# Altium schematic sheet HELPME.SchDoc
size Legal
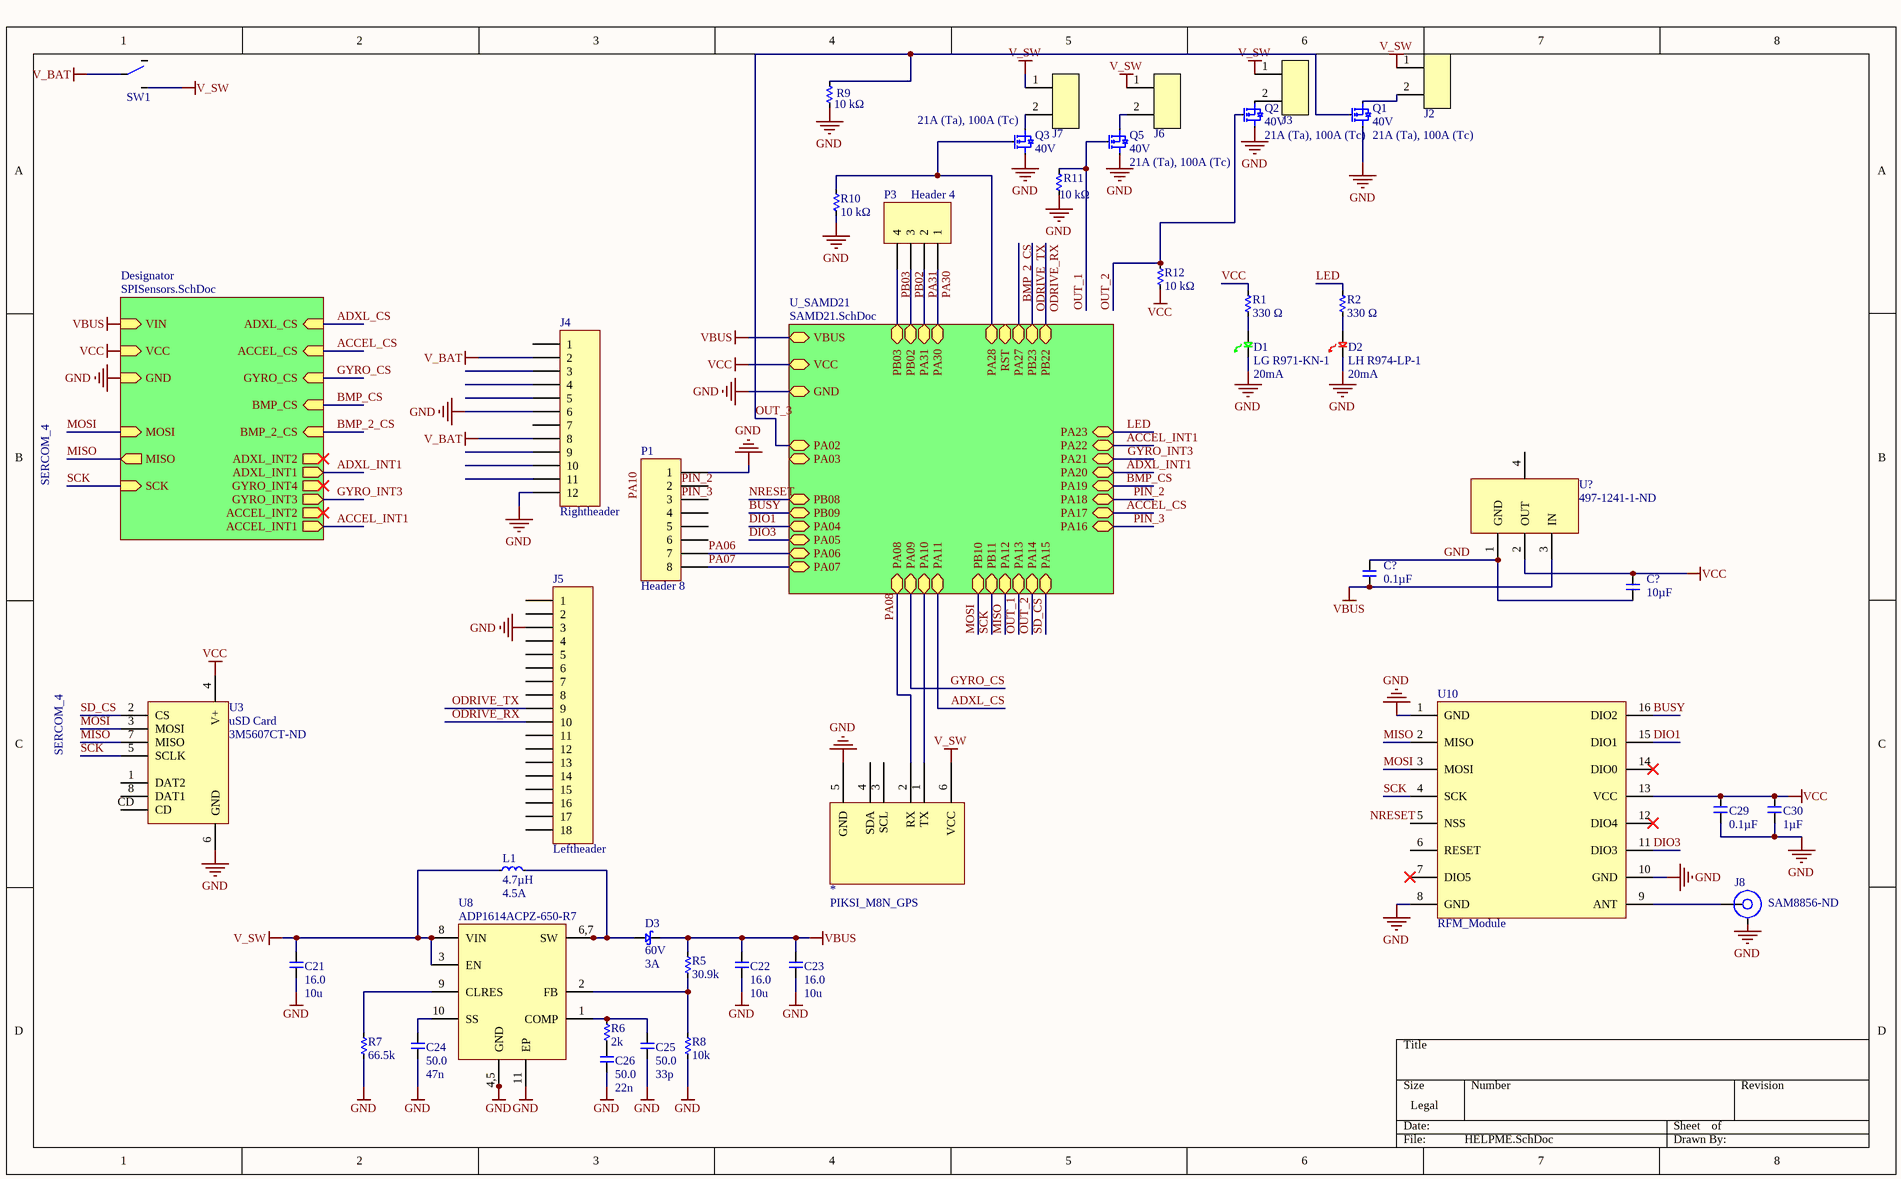
[diagram p0: HELPME.SchDoc]

## Parts
(Parts that share a designator on the sheet are numbered #1, #2 ... from top to bottom, then left to right.)
*  PIKSI_M8N_GPS  [PIKSI_M8N_GPS]
C21  voltage: 16.0  human_value: 10u  [C0805]  (hidden comment: __template_cap)
C22  voltage: 16.0  human_value: 10u  [C0805]  (hidden comment: __template_cap)
C23  voltage: 16.0  human_value: 10u  [C0805]  (hidden comment: __template_cap)
C24  voltage: 50.0  human_value: 47n  [C0805]  (hidden comment: __template_cap)
C25  voltage: 50.0  human_value: 33p  [C0805]  (hidden comment: __template_cap)
C26  voltage: 50.0  human_value: 22n  [C0805]  (hidden comment: __template_cap)
C29  Capacitance (shorthand): 0.1µF  [C0603]  (hidden comment: __template_cap)
C30  Capacitance (shorthand): 1µF  [C0603]  (hidden comment: __template_cap)
C?#1  Capacitance (shorthand): 0.1µF  [C0603]  (hidden comment: __template_cap)
C?#2  Capacitance (shorthand): 10µF  [C0603]  (hidden comment: __template_cap)
D1  Manufacturer Part Number: LG R971-KN-1  Current - Test: 20mA  [0805_Diode]  (hidden comment: LED_LY971)
D2  Manufacturer Part Number: LH R974-LP-1  Current - Test: 20mA  [0805_Diode]  (hidden comment: LED_LY974)
D3  Voltage - DC Reverse (Vr) (Max): 60V  Current - Average Rectified (Io): 3A  [SMA]  (hidden comment: SCHOTTKY_B360A-13-F)
J2  CONN_BARRIER_STRIP_2POS  [TE_BARRIER_STRIP_2POS]  (value not drawn)
J3  CONN_BARRIER_STRIP_2POS  [TE_BARRIER_STRIP_2POS]  (value not drawn)
J4  Rightheader  [HDR1X12]
J5  Leftheader  [HDR1X18]
J6  CONN_BARRIER_STRIP_2POS  [TE_BARRIER_STRIP_2POS]  (value not drawn)
J7  CONN_BARRIER_STRIP_2POS  [TE_BARRIER_STRIP_2POS]  (value not drawn)
J8  Supplier Part Number 1: SAM8856-ND  [SMA_SAMTEC_SMA-J-P-X-RA-TH1]  (hidden comment: SMA_SAMTEC_TH_RA)
L1  Inductance: 4.7µH  Current Rating: 4.5A  [SMD5230]  (hidden comment: IND_IHLP2020CZER4R7M11)
P1  Header 8  [HDR1X8]
P3  Header 4  [HDR1X4]
Q1  Drain to Source Voltage (Vdss): 40V  Current - Continuous Drain (Id) @ 25°C: 21A (Ta), 100A (Tc)  [8PTDFN]  (hidden comment: NFET_BSC035N04LSG)
Q2  Drain to Source Voltage (Vdss): 40V  Current - Continuous Drain (Id) @ 25°C: 21A (Ta), 100A (Tc)  [8PTDFN]  (hidden comment: NFET_BSC035N04LSG)
Q3  Drain to Source Voltage (Vdss): 40V  Current - Continuous Drain (Id) @ 25°C: 21A (Ta), 100A (Tc)  [8PTDFN]  (hidden comment: NFET_BSC035N04LSG)
Q5  Drain to Source Voltage (Vdss): 40V  Current - Continuous Drain (Id) @ 25°C: 21A (Ta), 100A (Tc)  [8PTDFN]  (hidden comment: NFET_BSC035N04LSG)
R1  Resistance: 330 Ω  [R0603]  (hidden comment: __template_resistor)
R2  Resistance: 330 Ω  [R0603]  (hidden comment: __template_resistor)
R5  value 30.9k  [R0603]  (hidden comment: __template_resistor)
R6  value 2k  [R0603]  (hidden comment: __template_resistor)
R7  value 66.5k  [R0603]  (hidden comment: __template_resistor)
R8  value 10k  [R0603]  (hidden comment: __template_resistor)
R9  Resistance: 10 kΩ  [R0805]  (hidden comment: __template_resistor)
R10  Resistance: 10 kΩ  [R0805]  (hidden comment: __template_resistor)
R11  Resistance: 10 kΩ  [R0805]  (hidden comment: __template_resistor)
R12  Resistance: 10 kΩ  [R0805]  (hidden comment: __template_resistor)
SW1  SWITCH_500SSP1S1M6QEA  [SWITCH_500SSP1S1M6QEA]  (value not drawn)
U3  uSD Card  Supplier Part Number 1: 3M5607CT-ND  [MICROSD_CARD_SOCKET]
U8  Manufacturer Part Number: ADP1614ACPZ-650-R7  [10DFN3X3]  (hidden comment: BOOST_ADP1614_650_R7)
U10  RFM_Module  [RFM-22]
U?  Supplier Part Number 1: 497-1241-1-ND  [4SOT223]  (hidden comment: LDO_LD1117S33CTR)

## Sub-sheets
Designator = SPISensors.SchDoc: VIN (in), ACCEL_CS (in), ADXL_CS (in), BMP_CS (in), GYRO_CS (in), VCC (in), GND (in), MOSI (in), MISO (out), SCK (in), GYRO_INT4 (out), ADXL_INT1 (out), GYRO_INT3 (out), ADXL_INT2 (out), ACCEL_INT2 (out), ACCEL_INT1 (out), BMP_2_CS (in)
U_SAMD21 = SAMD21.SchDoc: PB10 (bidir), PA15 (bidir), PA12 (bidir), GND (bidir), RST (bidir), PA28 (bidir), PA08 (bidir), PA09 (bidir), PA10 (bidir), VCC (bidir), PA11 (bidir), PB11 (bidir), PA13 (bidir), PA14 (bidir), PA02 (bidir), PA03 (bidir), PB08 (bidir), PB09 (bidir), PA04 (bidir), PA05 (bidir), PA06 (bidir), PA07 (bidir), PA17 (bidir), PA18 (bidir), PA19 (bidir), PA20 (bidir), PA21 (bidir), PA22 (bidir), PA23 (bidir), PA30 (bidir), PB23 (bidir), PB22 (bidir), PA27 (bidir), PA31 (bidir), VBUS (bidir), PB03 (bidir), PB02 (bidir), PA16 (bidir)

## Nets
GND: *.5(GND) C21.2 C22.2 C23.2 C24.2 C25.2 C26.2 C29.2 C30.2 C?#1.1 C?#2.2 D1.1 D2.1 J4.6 J4.12 J5.3 P1.1 Q1.2 Q2.2 Q3.2 Q5.2 R7.1 R8.1 R9.1 R10.2 R11.2 U3.6(GND) U8.4,5(GND) U8.5(GND2) U8.11(EP) U10.1(GND) U10.8(GND) U10.10(GND) U?.1(GND) ; sheet U_SAMD21/GND, sheet Designator/GND
V_BAT: J4.2 J4.8 SW1.2
V_SW: *.6(VCC) C21.1 J2.1 J3.1 J6.1 J7.1 L1.1 SW1.1 U8.3(EN) U8.8(VIN)
VBUS: C22.1 C23.1 C?#1.2 D3.2 R5.2 U?.3(IN) ; sheet U_SAMD21/VBUS, sheet Designator/VIN
VCC: C29.1 C30.1 C?#2.1 R1.2 R12.1 U3.4(V+) U10.13(VCC) U?.2(OUT) ; sheet U_SAMD21/VCC, sheet Designator/VCC
ACCEL_CS: sheet U_SAMD21/PA17, sheet Designator/ACCEL_CS
ACCEL_INT1: sheet U_SAMD21/PA22, sheet Designator/ACCEL_INT1
ADXL_CS: sheet U_SAMD21/PA11, sheet Designator/ADXL_CS
ADXL_INT1: sheet U_SAMD21/PA20, sheet Designator/ADXL_INT1
BMP_2_CS: sheet U_SAMD21/PA27, sheet Designator/BMP_2_CS
BMP_CS: sheet U_SAMD21/PA19, sheet Designator/BMP_CS
BUSY: U10.16(DIO2) ; sheet U_SAMD21/PB09
DIO1: U10.15(DIO1) ; sheet U_SAMD21/PA04
DIO3: U10.11(DIO3) ; sheet U_SAMD21/PA05
GYRO_CS: sheet U_SAMD21/PA09, sheet Designator/GYRO_CS
GYRO_INT3: sheet U_SAMD21/PA21, sheet Designator/GYRO_INT3
LED: R2.2 ; sheet U_SAMD21/PA23
MISO: U3.7(MISO) U10.2(MISO) ; sheet U_SAMD21/PA12, sheet Designator/MISO
MOSI: U3.3(MOSI) U10.3(MOSI) ; sheet U_SAMD21/PB10, sheet Designator/MOSI
NRESET: sheet U_SAMD21/PB08
ODRIVE_RX: J5.10 ; sheet U_SAMD21/PB22
ODRIVE_TX: J5.9 ; sheet U_SAMD21/PB23
OUT_1: Q5.1 R11.1 ; sheet U_SAMD21/PA13
OUT_2: Q2.1 R12.2 ; sheet U_SAMD21/PA14
OUT_3: Q1.1 R9.2 ; sheet U_SAMD21/PA02
PA06: P1.7 ; sheet U_SAMD21/PA06
PA07: P1.8 ; sheet U_SAMD21/PA07
PA08: *.2(RX) ; sheet U_SAMD21/PA08
PA30: P3.1 ; sheet U_SAMD21/PA30
PA31: P3.2 ; sheet U_SAMD21/PA31
PB02: P3.3 ; sheet U_SAMD21/PB02
PB03: P3.4 ; sheet U_SAMD21/PB03
PIN_2: sheet U_SAMD21/PA18
PIN_3: sheet U_SAMD21/PA16
SCK: U3.5(SCLK) U10.4(SCK) ; sheet U_SAMD21/PB11, sheet Designator/SCK
SD_CS: U3.2(CS) ; sheet U_SAMD21/PA15
Net*_1: *.1(TX) ; sheet U_SAMD21/PA10
NetC24_1: C24.1 U8.10(SS)
NetC25_1: C25.1 R6.2 U8.1(COMP)
NetC26_1: C26.1 R6.1
NetD1_2: D1.2 R1.1
NetD2_2: D2.2 R2.1
NetD3_1: D3.1 L1.2 U8.6,7(SW) U8.7(SW2)
NetJ2_2: J2.2 Q1.3
NetJ3_2: J3.2 Q2.3
NetJ6_2: J6.2 Q5.3
NetJ7_2: J7.2 Q3.3
NetJ8_SIG: J8.SIG U10.9(ANT)
NetQ3_1: Q3.1 R10.1 ; sheet U_SAMD21/PA28
NetR5_1: R5.1 R8.2 U8.2(FB)
NetR7_2: R7.2 U8.9(CLRES)

Not connected (* = marked no-connect by the designer): * 3(SCL) 4(SDA); J4 1 3 4 5 7 9 10 11; J5 1 2 4 5 6 7 8 11 12 13 14 15 16 17 18; J8 GND; P1 2 3 4 5 6; SW1 3; U3 1(DAT2) 8(DAT1) CD; U10 5(NSS) 6(RESET) 7(DIO5)* 12(DIO4)* 14(DIO0)*; U? 4(GND)

## Notes on the sheet
- SERCOM_4
- Labels drawn without touching a wire or pin: GND, NRESET, PA10, PIN_2, PIN_3

## Library data of the parts
C21-C23 = 587-1295-1-ND: type: capacitor; value: 1e-05; tolerance: 10%; Supplier Part Number 1: 587-1295-1-ND; package: 0805; price: 0.315
C24 = 478-1391-1-ND: type: capacitor; value: 4.7e-08; tolerance: 10%; Supplier Part Number 1: 478-1391-1-ND; package: 0805; price: 0.2
C25 = 399-1115-1-ND: type: capacitor; value: 3.3e-11; tolerance: 5%; Supplier Part Number 1: 399-1115-1-ND; package: 0805; price: 0.11
C26 = 478-1387-1-ND: type: capacitor; value: 2.2e-08; tolerance: 10%; Supplier Part Number 1: 478-1387-1-ND; package: 0805; price: 0.14
C29 = 490-1519-1-ND: CAP CER 0603 0.1µF X7R 50V 10%; Manufacturer: Murata Electronics North America; Capacitance - pF (Machine readable): #NAME?; type: capacitor; Rated Voltage: 50V; Supplier Part Number 1: 490-1519-1-ND; Dielectric: X7R; Supplier 1: Digikey
C30 = 490-3900-1-ND: CAP CER 0603 1µF X7R 16V 10%; Manufacturer: Murata Electronics North America; Capacitance - pF (Machine readable): #NAME?; type: capacitor; Rated Voltage: 16V; Supplier Part Number 1: 490-3900-1-ND; Dielectric: X7R; Supplier 1: Digikey
C?#1 = CAP CER 0603 0.1µF X7R 50V 10%: Manufacturer: Murata Electronics North America; Capacitance - pF (Machine readable): 100000; type: capacitor; Dielectric: X7R; Supplier 1: Digikey; Supplier Part Number 1: 490-1519-1-ND
C?#2 = CAP CER 10UF 35V X5R 0603 20%: Manufacturer: Murata Electronics North America; Capacitance - pF (Machine readable): 10000000; type: capacitor; Dielectric: X5R; Supplier 1: Digikey; Supplier Part Number 1: 490-13248-1-ND
D1 = LED_LY971: LED 0805 GREEN 20MA; Manufacturer: OSRAM Opto Semiconductors Inc; Wavelength - Dominant: 570nm; Wavelength - Peak: 572nm; Millicandela Rating: 26.05mcd; Voltage - Forward (Vf) (Typ): 2.2V; Viewing Angle: 160°; Lens Transparency: Diffused; Lens Color: White; Lens Style/Size: Rectangle with Flat Top, 1.30mm x 1.25mm; Supplier 1: Digi-Key; RoHS: RoHS Compliant; Category: Optoelectronics; Stock 1: 89733; Pricing 1: 1=0.08, 10=0.069, 100=0.0548, 250=0.04796, 500=0.04384 (USD); Packaging: Cut Tape (CT); Color: Green; Package / Case: 0805 (2012 Metric); Supplier Device Package: *; Size / Dimension: 2.00mm L x 1.25mm W; Height (Max): 0.80mm; Mounting Type: Surface Mount; ComponentLink1URL: http://www.osram-os.com/Graphics/XPic9/00078860_0.pdf; ComponentLink1Description: http://www.osram-os.com/Graphics/XPic9/00078860_0.pdf; Supplier Part Number 1: 475-1410-1-ND
D2 = LED_LY974: LED 0805 RED 20MA; Manufacturer: OSRAM Opto Semiconductors Inc; Wavelength - Dominant: 645nm; Wavelength - Peak: 660nm; Millicandela Rating: 41mcd; Voltage - Forward (Vf) (Typ): 1.8V; Viewing Angle: 160°; Lens Transparency: Diffused; Lens Color: White; Lens Style/Size: Rectangle with Flat Top, 1.30mm x 1.25mm; Supplier 1: Digi-Key; RoHS: RoHS Compliant; Category: Optoelectronics; Stock 1: 66379; Pricing 1: 1=0.08, 10=0.07, 100=0.0559, 250=0.04892, 500=0.04472 (USD); Packaging: Cut Tape (CT); Color: Red; Package / Case: 0805 (2012 Metric); Supplier Device Package: *; Size / Dimension: 2.00mm L x 1.25mm W; Height (Max): 0.80mm; Mounting Type: Surface Mount; ComponentLink1URL: http://www.osram-os.com/Graphics/XPic8/00078869_0.pdf; ComponentLink1Description: http://www.osram-os.com/Graphics/XPic8/00078869_0.pdf; Supplier Part Number 1: 475-1415-1-ND
D3 = SCHOTTKY_B360A-13-F: DIODE SCHOTTKY 40V 3A SMA; Manufacturer: Diodes Incorporated; Voltage - Forward (Vf) (Max) @ If: 700mV @ 3A; Speed: Fast Recovery =< 500ns, > 200mA (Io); Current - Reverse Leakage @ Vr: 500µA @ 60V; Capacitance @ Vr, F: 200pF @ 4V, 1MHz; Supplier 1: Digi-Key; Manufacturer Part Number: B360A-13-F; RoHS: RoHS Compliant; Category: Discrete Semiconductor Products; Stock 1: 71246; Pricing 1: 1=0.45, 10=0.363 (USD); Packaging: Cut Tape (CT); Part Status: Active; Diode Type: Schottky; Reverse Recovery Time (trr): -; Mounting Type: Surface Mount; Package / Case: DO-214AC, SMA; Supplier Device Package: SMA; Operating Temperature - Junction: -55°C ~ 150°C; ComponentLink1URL: http://www.diodes.com/_files/datasheets/ds30891.pdf; ComponentLink1Description: http://www.diodes.com/_files/datasheets/ds30891.pdf; Supplier Part Number 1: B360A-FDICT-ND
J2 J3 J6 J7 = CONN_BARRIER_STRIP_2POS: CONN BARRIER STRIP 2CIRC .375; Manufacturer: TE Connectivity; Manufacturer Part Number: 3-1437664-0; Number of Circuits: 2; Pitch: 0.375" (9.53mm); Current Rating: 20A; Voltage Rating: 300V; Wire Gauge: 12-22 AWG; Top Termination: Screws with Captive Plate; Bottom Termination: PC Pin; Barrier Type: 2 Wall (Dual); Material - Insulation: Polyamide (PA), Nylon; Material Flammability Rating: UL94 V-0; Supplier 1: Digi-Key; RoHS: RoHS Compliant; Category: Connectors, Interconnects; Stock 1: 24942; Pricing 1: 1=0.52, 10=0.483, 25=0.4348, 50=0.3864, 100=0.3703, 250=0.33812, 500=0.322, 1000=0.26565, 2500=0.2415 (USD); Terminal Block Type: Barrier Block; Number of Wire Entries: 2; Number of Rows: 1; Features: -; Color: Black; Packaging: Bulk; Terminal Material: Steel; Terminal Finish: Zinc; Mounting Type: Through Hole; Operating Temperature: -40°C ~ 105°C; ComponentLink1URL: http://www.te.com/commerce/DocumentDelivery/DDEController?Action=srchrtrv&DocNm=3-1437664-0&DocType=Customer+Drawing&DocLang=English; ComponentLink1Description: Datasheet; Supplier Part Number 1: A98495-ND
J4 = Header 12: Header, 12-Pin; LatestRevisionDate: 17-Jul-2002; LatestRevisionNote: Re-released for DXP Platform.; Publisher: Altium Limited
J5 = Header 18: Header, 18-Pin; LatestRevisionDate: 17-Jul-2002; LatestRevisionNote: Re-released for DXP Platform.; Publisher: Altium Limited
L1 = IND_IHLP2020CZER4R7M11: INDUCTOR POWER 4.7UH 4.5A SMD; Manufacturer: Vishay Dale; Current - Saturation: 5.2A; Tolerance: ±20%; Shielding: Shielded; DC Resistance (DCR): 60 mOhm Max; Frequency - Test: 100kHz; Supplier 1: Digi-Key; Manufacturer Part Number: IHLP2020CZER4R7M11; RoHS: RoHS Compliant; Category: Inductors, Coils, Chokes; Stock 1: 5793; Pricing 1: 1=1.35, 10=1.251, 25=1.1552, 50=0.9626, 100=0.9048 (USD); Type: -; Material - Core: -; Q @ Freq: -; Frequency - Self Resonant: -; Operating Temperature: -55°C ~ 125°C; Package / Case: Non Standard; Size / Dimension: 0.216" L x 0.204" W x 0.118" H (5.49mm x 5.18mm x 3.00mm); Mounting Type: Surface Mount; Packaging: Cut Tape (CT); ComponentLink1URL: http://www.vishay.com/docs/34260/lp20cz11.pdf; ComponentLink1Description: Datasheet; Supplier Part Number 1: 541-1238-1-ND
P1 = Header 8: Header, 8-Pin; LatestRevisionDate: 17-Jul-2002; LatestRevisionNote: Re-released for DXP Platform.; Publisher: Altium Limited
P3 = Header 4: Header, 4-Pin; LatestRevisionDate: 17-Jul-2002; LatestRevisionNote: Re-released for DXP Platform.; Publisher: Altium Limited
Q1-Q3 Q5 = NFET_BSC035N04LSG: MOSFET N-CH 40V 100A TDSON-8; Manufacturer: Infineon Technologies; Manufacturer Part Number: BSC035N04LSGATMA1; FET Type: MOSFET N-Channel, Metal Oxide; FET Feature: Logic Level Gate; Rds On (Max) @ Id, Vgs: 3.5 mOhm @ 50A, 10V; Vgs(th) (Max) @ Id: 2V @ 36µA; Gate Charge (Qg) @ Vgs: 64nC @ 10V; Input Capacitance (Ciss) @ Vds: 5100pF @ 20V; Power - Max: 69W; Supplier 1: Digi-Key; RoHS: RoHS Compliant; Category: Discrete Semiconductor Products; Stock 1: 22194; Pricing 1: 1=0.95, 10=0.833, 100=0.637, 500=0.5047, 1000=0.40425 (USD); Packaging: Cut Tape (CT); Operating Temperature: -55°C ~ 150°C (TJ); Mounting Type: Surface Mount; Package / Case: 8-PowerTDFN; Supplier Device Package: PG-TDSON-8; ComponentLink1URL: http://www.infineon.com/dgdl/BSC035N04LSG_rev1.02.pdf?folderId=db3a3043156fd5730115c7d50620107c&fileId=db3a30431689f4420116c4388f820817; ComponentLink1Description: http://www.infineon.com/dgdl/BSC035N04LSG_rev1.02.pdf?folderId=db3a3043156fd5730115c7d50620107c&fileId=db3a30431689f4420116c4388f820817; Supplier Part Number 1: BSC035N04LSGATMA1CT-ND
R1 R2 = RES SMD 330 OHM 1% 1/10W 0603: Manufacturer Part Number: RC0603FR-07330RL; Manufacturer: Yageo; Resistance (Sortable): 330; Tolerance: ±1%; Power (Watts): 0.1W, 1/10W; Temperature Coefficient: ±100ppm/°C; Supplier 1: Digikey; Datasheets: http://www.yageo.com/documents/recent/PYu-RC_Group_51_RoHS_L_9.pdf; Image: //media.digikey.com/Renders/Yageo%20Renders/0603-(1608-Metric).jpg; Supplier Part Number 1: 311-330HRCT-ND; Operating Temperature: -55°C ~ 155°C
R5 = CRCW060330K9FKEA: RES SMD 30.9K OHM 1% 1/10W 0603; Manufacturer: Vishay Dale; Resistance (Machine readable): 30900; Unit Price (USD): 0.081; Power (Watts): 0.1W, 1/10W; Supplier Part Number: 541-30.9KHCT-ND; Manufacturer Part Number: CRCW060330K9FKEA; type: resistor; Packaging: Cut Tape (CT); Series: CRCW; Tolerance: ±1%; Package: 0603 (1608 Metric)
R6 = CRCW06032K00FKEA: RES SMD 2K OHM 1% 1/10W 0603; Manufacturer: Vishay Dale; Resistance (Machine readable): 2000; Unit Price (USD): 0.081; Power (Watts): 0.1W, 1/10W; Supplier Part Number: 541-2.00KHCT-ND; Manufacturer Part Number: CRCW06032K00FKEA; type: resistor; Packaging: Cut Tape (CT); Series: CRCW; Tolerance: ±1%; Package: 0603 (1608 Metric)
R7 = CRCW060366K5FKEA: RES SMD 66.5K OHM 1% 1/10W 0603; Manufacturer: Vishay Dale; Resistance (Machine readable): 66500; Unit Price (USD): 0.081; Power (Watts): 0.1W, 1/10W; Supplier Part Number: 541-66.5KHCT-ND; Manufacturer Part Number: CRCW060366K5FKEA; type: resistor; Packaging: Cut Tape (CT); Series: CRCW; Tolerance: ±1%; Package: 0603 (1608 Metric)
R8 = CRCW060310K0FKEA: RES SMD 10K OHM 1% 1/10W 0603; Manufacturer: Vishay Dale; Resistance (Machine readable): 10000; Unit Price (USD): 0.081; Power (Watts): 0.1W, 1/10W; Supplier Part Number: 541-10.0KHCT-ND; Manufacturer Part Number: CRCW060310K0FKEA; type: resistor; Packaging: Cut Tape (CT); Series: CRCW; Tolerance: ±1%; Package: 0603 (1608 Metric)
R9-R12 = RES SMD 10K OHM 1% 1/8W 0805: Manufacturer Part Number: RC0805FR-0710KL; Manufacturer: Yageo; Resistance (Sortable): 10000; Tolerance: ±1%; Power (Watts): 0.125W, 1/8W; Temperature Coefficient: ±100ppm/°C; Supplier 1: Digikey; Datasheets: http://www.yageo.com/documents/recent/PYu-RC_Group_51_RoHS_L_9.pdf; Image: //media.digikey.com/Renders/Yageo%20Renders/0805-(2012-Metric).jpg; Supplier Part Number 1: 311-10.0KCRCT-ND; Operating Temperature: -55°C ~ 155°C
SW1 = SWITCH_500SSP1S1M6QEA: SWITCH SLIDE SPDT R/A 5A; Manufacturer: E-Switch; Contact Timing: Not Specified; Switch Function: On-On; Current Rating: 5A (AC/DC); Voltage Rating - AC: 120V; Voltage Rating - DC: 28V; Actuator Type: Standard; Actuator Length: 4.72mm; Actuator Material: Polyamide (PA), Nylon; Switch Travel: 2.16mm; Mechanical Life: 30,000 Cycles; Supplier 1: Digi-Key; Manufacturer Part Number: 500SSP1S1M6QEA; RoHS: RoHS Compliant; Category: Switches; Stock 1: 8402; Pricing 1: 1=2.93, 10=2.808, 25=2.7484, 50=2.39, 100=2.3303, 250=2.27052, 500=1.912, 1000=1.7925, 5000=1.64313 (USD); Packaging: Bulk; Part Status: Active; Circuit: SPDT; Contact Material: Copper Alloy; Contact Finish: Silver; Mounting Type: Through Hole, Right Angle; Termination Style: PC Pin; Features: Epoxy Sealed Terminals; Operating Temperature: -30°C ~ 85°C; Electrical Life: 30,000 Cycles; Operating Force: -; ComponentLink1URL: http://spec_sheets.e-switch.com/specs/T511006.pdf; ComponentLink1Description: http://spec_sheets.e-switch.com/specs/T511006.pdf; Supplier Part Number 1: EG2478-ND
U3 = MICRO_SD_CARD_HOLDER: MICROSD CARD HOLDER, PUSH-PUSH; pin to pad: 6>6+SHIELD1+SHIELD2+SHIELD3; Manufacturer: 3M; Manufacturer Part Number: 2908-05WB-MG; Card Type: Secure Digital - microSD™; Number of Positions: 10 (8 + 2); Connector Type: Connector and Ejector; Insertion, Removal Method: Push In, Push Out; Supplier 1: Digi-Key; RoHS: RoHS Compliant; Category: Connectors, Interconnects; Stock 1: 32313; Pricing 1: 1=3.6, 10=3.458, 25=3.1704, 50=3.0262, 100=2.882, 250=2.52176, 500=2.4497, 1000=2.08945 (USD); Packaging: Cut Tape (CT); Ejector Side: -; Mounting Type: Surface Mount, Right Angle; Features: Switch; Height Above Board: 0.073" (1.85mm); Mounting Feature: Normal, Standard - Top; Contact Finish: Gold; Contact Finish Thickness: 15µin (0.38µm); ComponentLink1URL: http://multimedia.3m.com/mws/media/416257O/3mtm-card-connector-microsdtm-2900-series-ts2197.pdf; ComponentLink1Description: http://multimedia.3m.com/mws/media/416257O/3mtm-card-connector-microsdtm-2900-series-ts2197.pdf
U8 = BOOST_ADP1614_650_R7: IC BOOST ADJ 4A 10DFN 650kHZ; Manufacturer: Analog Devices Inc.; Function: Step-Up; Output Configuration: Positive; Output Type: Adjustable; Number of Outputs: 1; Voltage - Input (Min): 2.5V; Voltage - Input (Max): 5.5V; Voltage - Output (Max): 20V; Current - Output: 4A (Switch); Synchronous Rectifier: No; Supplier 1: Digi-Key; RoHS: RoHS Compliant; Category: Integrated Circuits (ICs); Stock 1: 513; Pricing 1: 1=2.81, 10=2.528, 100=2.0321, 500=1.66956 (USD); Packaging: Cut Tape (CT); Part Status: Active; Topology: Boost; Voltage - Output (Min/Fixed): 2.5V; Frequency - Switching: 650kHz; Operating Temperature: -40°C ~ 125°C (TJ); Mounting Type: Surface Mount; Package / Case: 10-WFDFN Exposed Pad, CSP; Supplier Device Package: 10-LFCSP-WD (3x3); ComponentLink1URL: http://www.analog.com/media/en/technical-documentation/data-sheets/ADP1614.pdf; ComponentLink1Description: http://www.analog.com/media/en/technical-documentation/data-sheets/ADP1614.pdf; Supplier Part Number 1: ADP1614ACPZ-650-R7CT-ND
U? = LDO_LD1117S33CTR: IC VOLTAGE REG 3.3V 800MA SOT223 INDUSTRIAL TEMP; Manufacturer: STMicroelectronics; Regulator Topology: Positive Fixed; Voltage - Dropout (Typical): 1.1V @ 800mA; Number of Regulators: 1; Voltage - Input: Up to 15V; Supplier 1: Digi-Key; Manufacturer Part Number: LD1117S33CTR; RoHS: RoHS Compliant; Category: Integrated Circuits (ICs); Stock 1: 63873; Pricing 1: 1=0.46, 10=0.373, 100=0.2538, 500=0.19034, 1000=0.14276 (USD); Packaging: Cut Tape (CT); Part Status: Active; Voltage - Output: 3.3V; Current - Output: 800mA; Current - Limit (Min): -; Operating Temperature: -40°C ~ 125°C; Mounting Type: Surface Mount; Package / Case: TO-261-4, TO-261AA; Supplier Device Package: SOT-223; ComponentLink1URL: http://www.st.com/content/ccc/resource/technical/document/datasheet/99/3b/7d/91/91/51/4b/be/CD00000544.pdf/files/CD00000544.pdf/jcr:content/translations/en.CD00000544.pdf; ComponentLink1Description: http://www.st.com/content/ccc/resource/technical/document/datasheet/99/3b/7d/91/91/51/4b/be/CD00000544.pdf/files/CD00000544.pdf/jcr:content/translations/en.CD00000544.pdf
J8 = SMA_SAMTEC_TH_RA: Supplier 1: Digi-Key